# EasyEDA Pro project 串口模块.epro, board 车载普通串口V1
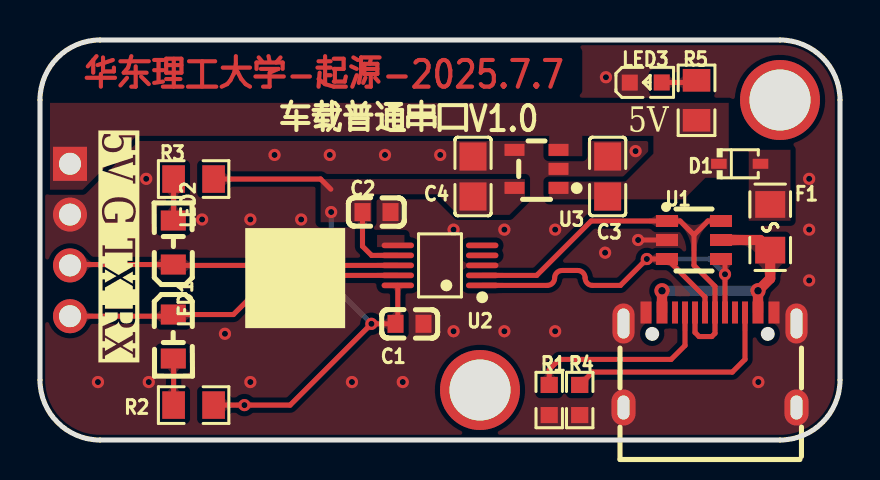
[diagram p10: board, top side]
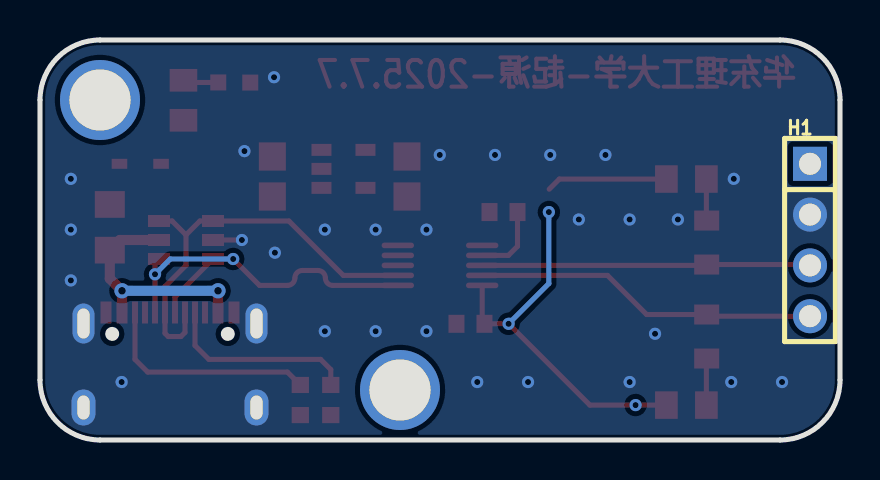
[diagram p11: board, bottom side, seen from below]

Outline 40 x 20 mm; copper layers: Top Layer, Bottom Layer. Coordinates in mm from the lower left corner of the outline.
Outline path: 0,17 0,3 arc(0.88,0.88) 3,0 37,0 arc(39.12,0.88) 40,3 40,17 arc(39.12,19.12) 37,20 3,20 arc(0.88,19.12) 0,17
Stack: Top Layer 0.035mm / Dielectric1 1.51mm FR4 er 4.5 / Bottom Layer 0.035mm

## Design rules (mm)
net D+: DP1
net D-: DP1
template: xyf_v1.1
spacing copperThickness1oz (default): track to track 0.102, other pairs 0.152 to 0.3
spacing copperThickness2oz: track to track 0.203, other pairs 0.152 to 0.3
spacing copperThicknessInner0.5oz: track to track 0.089, other pairs 0.152 to 0.3
spacing 0焊盘板框间距: track to track 0.152, other pairs 0 to 0.3
track width copperThickness1oz (default): min 0.127, default 0.254, max 2.54
track width copperThickness2oz: min 0.203, default 0.254, max 2.54
track width copperThickness0.5oz: min 0.089, default 0.254, max 2.54
differential pair differentialPair (default): width min 0.127, default 0.254, max 2.54; gap min 0.152, default 0.152
via viaSize (default): diameter min 0.5, default 0.61, max 10; hole min 0.3, default 0.305, max 6.3
via viaSize2: diameter min 0.5, default 0.61, max 10; hole min 0.3, default 0.305, max 6.299
via viaSize4: diameter min 0.45, default 0.61, max 10; hole min 0.3, default 0.305, max 6.299

## Placement (name value [footprint] x y rotation side)
C1  100nF  [C0603]  18.48 5.81 180 top
C2  100nF  [C0603]  16.82 11.4 0 top
C3  10uF  [C0805]  28.38 13.17 270 top
C4  10uF  [C0805]  21.65 13.17 270 top
D1  B5817WS  [SOD-323_L1.7-W1.3-LS2.5-FD]  34.99 13.81 180 top
F1  SMD0805B050TF  [F0805]  36.51 10.64 270 top
H1  PZ254V-11-04P  [HDR-TH_4P-P2.54-V-M]  1.5 10 270 bottom
LED1  XL-2012UPC  [LED0805-RD_PINK]  6.66 5.17 270 top
LED2  E6C0805TKAY1UDA  [LED0805-RD_BLUE]  6.66 9.87 90 top
LED3  XL-1608SURC-06  [LED0603-RD_RED]  30.29 17.87 0 top
QR1  -  [JLC-QRCODE-5x5]  12.76 8.09 0 top
R1  5.1kΩ  [R0603]  25.46 2 270 top
R2  1kΩ  [R0805]  7.68 1.75 0 top
R3  1kΩ  [R0805]  7.68 13.05 0 top
R4  5.1kΩ  [R0603]  26.99 2 90 top
R5  1kΩ  [R0805]  32.83 16.98 270 top
SCREW1  -  [M2螺丝]  37 17 0 top
SCREW2  -  [M2螺丝]  22 2.5 0 top
U1  USBLC6-2SC6-ES  [SOT-23-6_L2.9-W1.6-P0.95-LS2.8-BR]  32.7 10 180 top
U2  CH340X  [MSOP-10_L3.0-W3.0-P0.50-LS5.0-BL]  20 8.73 90 top
U3  RT9013-33GB-MS  [SOT-23-5_L2.9-W1.6-P0.95-LS2.8-BR]  24.83 13.56 0 top
USB1  TYPE-C 16PIN 2MD(073)  [USB-C-SMD_TYPE-C-6PIN-2MD-073]  33.5 4 0 top

## Footprints (pads in the part's own frame, mm; a bottom-side part is the same pattern mirrored in y, then rotated)
C0603
  rect 0.8x0.9 smd: 1(-0.7,0) 2(0.7,0)
C0805
  rect 1.41x1.35 smd: 1(-1,0) 2(1,0)
F0805
  rect 1.335x1.5 smd: 1(-1.143,0) 2(1.143,0)
HDR-TH_4P-P2.54-V-M
  rect 1.7x1.7 hole 1.1: 1(-3.81,0)
  round 1.7 hole 1.1: 2(-1.27,0) 3(1.27,0) 4(3.81,0)
LED0603-RD_RED
  rect 0.8x0.8 smd: 1(-0.799,-0.004) 2(0.799,0.004)
LED0805-RD_BLUE
  rect 1x1.25 smd: 1(-1.1,0) 2(1.1,0)
LED0805-RD_PINK
  rect 1x1.25 smd: 1(-1.1,0) 2(1.1,0)
M2螺丝
  round 4 hole 3.05x2.02: 1(0,0)
MSOP-10_L3.0-W3.0-P0.50-LS5.0-BL
  oval 0.28x1.62 smd: 1(-1,-2.11) 2(-0.5,-2.11) 3(0,-2.11) 4(0.5,-2.11) 5(1,-2.11) 6(1,2.11) 7(0.5,2.11) 8(0,2.11) 9(-0.5,2.11) 10(-1,2.11)
R0603
  rect 0.806x0.864 smd: 1(-0.753,0) 2(0.753,0)
R0805
  rect 1.133x1.377 smd: 1(-1,0) 2(1,0)
SOD-323_L1.7-W1.3-LS2.5-FD
  rect 0.78x0.5 smd: 1(-1.04,0) 2(1.04,0)
SOT-23-5_L2.9-W1.6-P0.95-LS2.8-BR
  rect 1x0.6 smd: 1(1.1,-0.95) 2(1.1,0) 3(1.1,0.95) 4(-1.1,0.95) 5(-1.1,-0.95)
SOT-23-6_L2.9-W1.6-P0.95-LS2.8-BR
  rect 1.1x0.6 smd: 1(1.35,-0.95) 2(1.35,0) 3(1.35,0.95) 4(-1.35,0.95) 5(-1.35,0) 6(-1.35,-0.95)
USB-C-SMD_TYPE-C-6PIN-2MD-073
  rect 0.55x1.1 smd: 1(-3.2,2.375) 2(-2.4,2.375) 11(2.4,2.375) 12(3.2,2.375)
  rect 0.3x1.1 smd: 3(-1.75,2.375) 4(-1.25,2.375) 5(-0.75,2.375) 6(-0.25,2.375) 7(0.25,2.375) 8(0.75,2.375) 9(1.25,2.375) 10(1.75,2.375)
  oval 1.1x2 hole 0.6x1.5: 13(-4.325,1.825) 14(4.325,1.825)
  oval 1.2x1.8 hole 0.6x1.2: 13(-4.325,-2.375) 14(4.325,-2.375)

## Nets
As in the schematic.

Pads without a net: SCREW1 1; SCREW2 1; U2 4 5 6; USB1 3 9

## Via types
v1: diameter 0.61, hole 0.305, Top Layer to Bottom Layer, 33 vias
v2: diameter 0.762, hole 0.381, Top Layer to Bottom Layer, 2 vias

## Routing (per net, layer and track width the routed paths; a pad name or vN(x,y) marks a point on that pad's centre or on a via; arc(x,y) is an arc through that point)
3V3: length 28.9
  Top Layer w0.254: U2.7 16.58,9.23 16.12,9.68 C2.1 ; R3.2 14.03,13.05 14.54,12.54 ; R2.2 v1(10.22,1.75) 12.51,1.75 v1(16.57,5.81) C1.2 17.89,5.92 U2.10
  Bottom Layer w0.254: v1(16.57,5.81) 14.56,7.82 v1(14.56,11.4)
GND: length 1.4
  Top Layer w0.254: U1.2 v1(29.91,10)
  vias: v1(2.9,2.9) v1(5.31,13.06) v1(5.44,2.9) v1(8.1,11.03) v1(9.25,5.31) v1(10.52,11.03) v1(10.52,2.9) v1(11.73,14.25) v1(13.06,11.03) v1(14.49,14.25) v1(15.6,2.9) v1(17.25,14.25) v1(18.14,2.9) v1(20.01,14.25) v1(20.68,10.52) v1(20.68,5.44) v1(23.22,10.52) v1(23.22,5.44) v1(25.76,10.52) v1(25.76,5.44) v1(28.3,18.14) v1(28.25,9.36) v1(29.78,14.44) v1(35.92,2.9) v1(38.46,13.06) v1(38.46,10.52) v1(38.46,7.98)
D+: length 21.1
  Top Layer w0.254: U2.1 25.36,7.73 arc(25.62,7.84) 25.73,8.1 arc(25.84,8.37) 26.1,8.48 26.88,8.48 arc(27.15,8.37) 27.26,8.1 arc(27.36,7.84) 27.63,7.73 29.02,7.73 v1(30.34,9.05) U1.3 33.25,7.15 USB1.6 ; U1.4 34.25,8.85 v1(34.25,8.29) USB1.8
  Bottom Layer w0.254: v1(30.34,9.05) 33.49,9.05 v1(34.25,8.29)
D-: length 21.1
  Top Layer w0.254: 32.7,10.25 33.4,10.95 U1.6 ; 32.7,10.25 32.7,8.73 33.75,7.68 USB1.7 33.75,5.33 33.59,5.17 32.95,5.17 32.75,5.38 USB1.5 ; 32.7,10.25 32,10.95 U1.1 27.55,10.95 24.83,8.23 U2.2
RX: length 17.2
  Top Layer w0.254: H1.4 6.58,6.19 LED1.1 9.67,6.27 11.63,8.23 U2.9
TX: length 16.4
  Top Layer w0.254: U2.8 6.71,8.73 6.66,8.77 1.54,8.77 H1.3
$1N3665: length 11.9
  Top Layer w0.508: USB1.2 v2(31.1,7.46) ; USB1.11 v2(35.9,7.46) 36.51,8.07 F1.2 36,10 U1.5
  Bottom Layer w0.508: v2(31.1,7.46) v2(35.9,7.46)
$1N11056: length 11.1
  Top Layer w0.254: USB1.10 35.25,4.03 34.62,3.4 27.63,3.4 R4.2
$1N11061: length 9.7
  Top Layer w0.254: R1.1 25.46,3.52 25.97,4.03 31.56,4.03 32.25,4.72 USB1.4
$1N22123: length 1.8
  Top Layer w0.254: R5.1 32.72,17.88 LED3.2
$1N22217: length 2.3
  Top Layer w0.254: R2.1 6.68,4.06 LED1.2
$1N22362: length 2.1
  Top Layer w0.254: R3.1 6.68,10.99 LED2.2

## Copper pours and planes (outline as drawn; the poured copper is in the pictures)
3V3 on Top Layer: 14.03,13.05 24.25,13.05 24.25,10.89 14.03,10.89
GND on Top Layer: -1.72,22.32 44.13,22.32 44.13,-6.13 -1.72,-6.13
GND on Bottom Layer: -1.72,22.32 44.13,22.32 44.13,-6.13 -1.72,-6.13
VIN on Top Layer: 25.46,15.33 33.46,15.33 33.46,12.03 25.46,12.03
VIN on Top Layer: 25.46,15.46 27.11,15.46 27.11,14.19 25.46,14.19
VIN on Top Layer: 0.5,16.86 34.44,16.86 34.44,12.52 0.5,12.52
$1N12744 on Top Layer: 35.43,14.51 37.53,14.51 37.53,10.96 35.43,10.96

Small or netless copper shapes (teardrops, artwork), in the pictures only: 58 on Top Layer, 6 on Bottom Layer

## Text on the board
Top Layer: 华东理工大学-起源-2025.7.7
Top Silkscreen Layer: 车载普通串口V1.0 | 5V | 5V G TX RX
